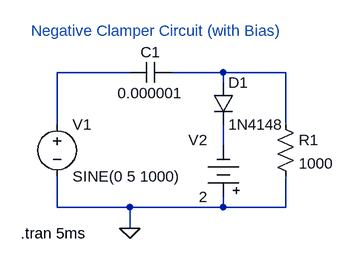
[diagram p0: schematic Assignment 2b (ii).asc]
Assignment 2b (ii).asc, the LTspice schematic file:
Version 4.1
SHEET 1 880 680
WIRE 176 80 64 80
WIRE 320 80 240 80
WIRE 416 80 320 80
WIRE 320 96 320 80
WIRE 64 160 64 80
WIRE 416 160 416 80
WIRE 320 192 320 160
WIRE 64 288 64 240
WIRE 176 288 64 288
WIRE 320 288 320 272
WIRE 320 288 176 288
WIRE 416 288 416 240
WIRE 416 288 320 288
WIRE 176 320 176 288
FLAG 176 320 0
SYMBOL voltage 64 144 R0
WINDOW 123 0 0 Left 0
WINDOW 39 0 0 Left 0
SYMATTR InstName V1
SYMATTR Value SINE(0 5 1000)
SYMBOL res 400 144 R0
SYMATTR InstName R1
SYMATTR Value 1000
SYMBOL cap 240 64 R90
WINDOW 0 0 32 VBottom 2
WINDOW 3 32 32 VTop 2
SYMATTR InstName C1
SYMATTR Value 0.000001
SYMBOL Misc\\battery 320 288 R180
WINDOW 0 24 104 Left 2
WINDOW 3 24 16 Left 2
WINDOW 123 0 0 Left 0
WINDOW 39 0 0 Left 0
SYMATTR InstName V2
SYMATTR Value 2
SYMBOL diode 304 96 R0
SYMATTR InstName D1
SYMATTR Value 1N4148
TEXT 8 328 Left 2 !.tran 5ms
TEXT 24 16 Left 2 ;Negative Clamper Circuit (with Bias)

The netlist it stands for:
* Assignment 2b (ii).asc
V1 N001 0 SINE(0 5 1000)
R1 N002 0 1000
C1 N002 N001 0.000001
V2 0 N003 2
D1 N002 N003 1N4148
.model D D
.lib standard.dio
.tran 5ms
* Negative Clamper Circuit (with Bias)
.backanno
.end